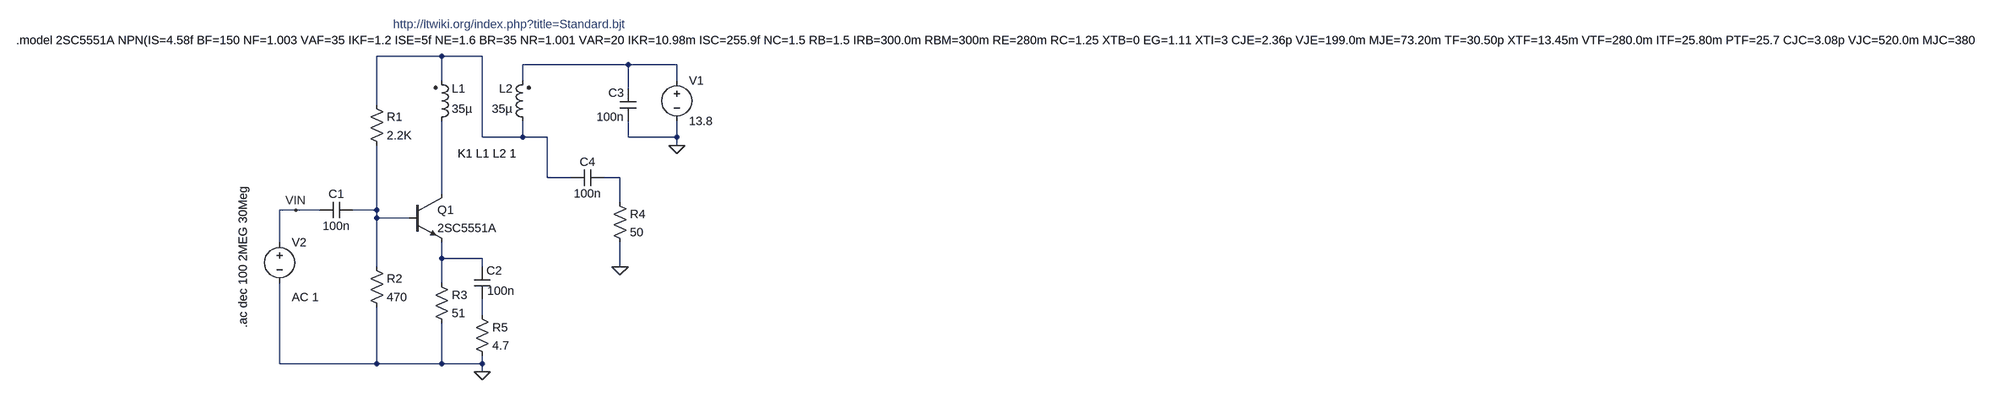
[diagram p0: schematic K&P_RF_AMP_TRANSORMER.asc]
K&P_RF_AMP_TRANSORMER.asc, the LTspice schematic file:
Version 4
SHEET 1 3972 680
WIRE 288 -144 160 -144
WIRE 368 -144 288 -144
WIRE 656 -128 448 -128
WIRE 752 -128 656 -128
WIRE 288 -96 288 -144
WIRE 448 -96 448 -128
WIRE 752 -96 752 -128
WIRE 656 -80 656 -128
WIRE 160 -48 160 -144
WIRE 368 16 368 -144
WIRE 448 16 448 -16
WIRE 448 16 368 16
WIRE 496 16 448 16
WIRE 656 16 656 -16
WIRE 752 16 752 -16
WIRE 752 16 656 16
WIRE 752 32 752 16
WIRE 496 96 496 16
WIRE 544 96 496 96
WIRE 640 96 608 96
WIRE 288 128 288 -16
WIRE 640 144 640 96
WIRE 0 160 -32 160
WIRE 48 160 0 160
WIRE 160 160 160 32
WIRE 160 160 112 160
WIRE 160 176 160 160
WIRE 224 176 160 176
WIRE -32 224 -32 160
WIRE 288 256 288 224
WIRE 368 256 288 256
WIRE 160 272 160 176
WIRE 368 272 368 256
WIRE 640 272 640 224
WIRE 288 304 288 256
WIRE 368 368 368 336
WIRE -32 464 -32 304
WIRE 160 464 160 352
WIRE 160 464 -32 464
WIRE 288 464 288 384
WIRE 288 464 160 464
WIRE 368 464 368 448
WIRE 368 464 288 464
WIRE 368 480 368 464
FLAG 752 32 0
FLAG 368 480 0
FLAG 0 160 VIN
FLAG 640 272 0
SYMBOL res 144 -64 R0
SYMATTR InstName R1
SYMATTR Value 2.2K
SYMBOL res 144 256 R0
SYMATTR InstName R2
SYMATTR Value 470
SYMBOL cap 112 144 R90
WINDOW 0 0 32 VBottom 2
WINDOW 3 32 32 VTop 2
SYMATTR InstName C1
SYMATTR Value 100n
SYMBOL npn 224 128 R0
SYMATTR InstName Q1
SYMATTR Value 2SC5551A
SYMBOL ind2 272 0 M180
WINDOW 0 36 80 Left 2
WINDOW 3 36 40 Left 2
SYMATTR InstName L1
SYMATTR Value 35µ
SYMATTR Type ind
SYMBOL res 272 288 R0
SYMATTR InstName R3
SYMATTR Value 51
SYMBOL cap 352 272 R0
WINDOW 3 26 48 Left 2
SYMATTR Value 100n
SYMATTR InstName C2
SYMBOL voltage 752 -112 R0
SYMATTR InstName V1
SYMATTR Value 13.8
SYMBOL voltage -32 208 R0
WINDOW 123 24 124 Left 2
WINDOW 39 24 44 Left 2
SYMATTR Value2 AC 1
SYMATTR InstName V2
SYMATTR Value ""
SYMBOL res 352 352 R0
SYMATTR InstName R5
SYMATTR Value 4.7
SYMBOL res 624 128 R0
SYMATTR InstName R4
SYMATTR Value 50
SYMBOL ind2 464 0 R180
WINDOW 0 36 80 Left 2
WINDOW 3 36 40 Left 2
SYMATTR InstName L2
SYMATTR Value 35µ
SYMATTR Type ind
SYMBOL cap 672 -16 R180
WINDOW 0 24 56 Left 2
WINDOW 3 24 8 Left 2
SYMATTR InstName C3
SYMATTR Value 100n
SYMBOL cap 608 80 R90
WINDOW 0 0 32 VBottom 2
WINDOW 3 32 32 VTop 2
SYMATTR InstName C4
SYMATTR Value 100n
TEXT -104 112 VRight 2 !.ac dec 100 2MEG 30Meg
TEXT -552 -176 Left 2 !.model 2SC5551A NPN(IS=4.58f BF=150 NF=1.003 VAF=35 IKF=1.2 ISE=5f NE=1.6 BR=35 NR=1.001 VAR=20 IKR=10.98m ISC=255.9f NC=1.5 RB=1.5 IRB=300.0m RBM=300m RE=280m RC=1.25 XTB=0 EG=1.11 XTI=3 CJE=2.36p VJE=199.0m MJE=73.20m TF=30.50p XTF=13.45m VTF=280.0m ITF=25.80m PTF=25.7 CJC=3.08p VJC=520.0m MJC=380.8m .15m TR=1.38n FC=1.51m )
TEXT 192 -208 Left 2 ;http://ltwiki.org/index.php?title=Standard.bjt
TEXT 320 48 Left 2 !K1 L1 L2 1

The netlist it stands for:
* K&P_RF_AMP_TRANSORMER.asc
R1 N001 N005 2.2K
R2 N005 0 470
C1 N005 VIN 100n
Q1 N004 N005 N006 0 2SC5551A
L1 N004 N001 35µ
R3 N006 0 51
C2 N006 N007 100n
V1 N002 0 13.8
V2 VIN 0 AC 1
R5 N007 0 4.7
R4 N003 0 50
L2 N001 N002 35µ
C3 0 N002 100n
C4 N003 N001 100n
.model NPN NPN
.model PNP PNP
.lib standard.bjt
.ac dec 100 2MEG 30Meg
.model 2SC5551A NPN(IS=4.58f BF=150 NF=1.003 VAF=35 IKF=1.2 ISE=5f NE=1.6 BR=35 NR=1.001 VAR=20 IKR=10.98m ISC=255.9f NC=1.5 RB=1.5 IRB=300.0m RBM=300m RE=280m RC=1.25 XTB=0 EG=1.11 XTI=3 CJE=2.36p VJE=199.0m MJE=73.20m TF=30.50p XTF=13.45m VTF=280.0m ITF=25.80m PTF=25.7 CJC=3.08p VJC=520.0m MJC=380.8m .15m TR=1.38n FC=1.51m )
* http://ltwiki.org/index.php?title=Standard.bjt
K1 L1 L2 1
.backanno
.end